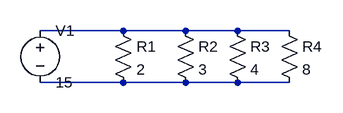
[diagram p0: schematic 4parallel.asc]
4parallel.asc, the LTspice schematic file:
Version 4
SHEET 1 880 680
WIRE 256 128 128 128
WIRE 352 128 256 128
WIRE 432 128 352 128
WIRE 512 128 432 128
WIRE 256 208 128 208
WIRE 352 208 256 208
WIRE 432 208 352 208
WIRE 512 208 432 208
SYMBOL voltage 128 112 R0
WINDOW 123 0 0 Left 0
WINDOW 39 0 0 Left 0
SYMATTR InstName V1
SYMATTR Value 15
SYMBOL res 240 112 R0
SYMATTR InstName R1
SYMATTR Value 2
SYMBOL res 336 112 R0
SYMATTR InstName R2
SYMATTR Value 3
SYMBOL res 416 112 R0
SYMATTR InstName R3
SYMATTR Value 4
SYMBOL res 496 112 R0
SYMATTR InstName R4
SYMATTR Value 8

The netlist it stands for:
* 4parallel.asc
V1 N001 N002 15
R1 N001 N002 2
R2 N001 N002 3
R3 N001 N002 4
R4 N001 N002 8
.backanno
.end